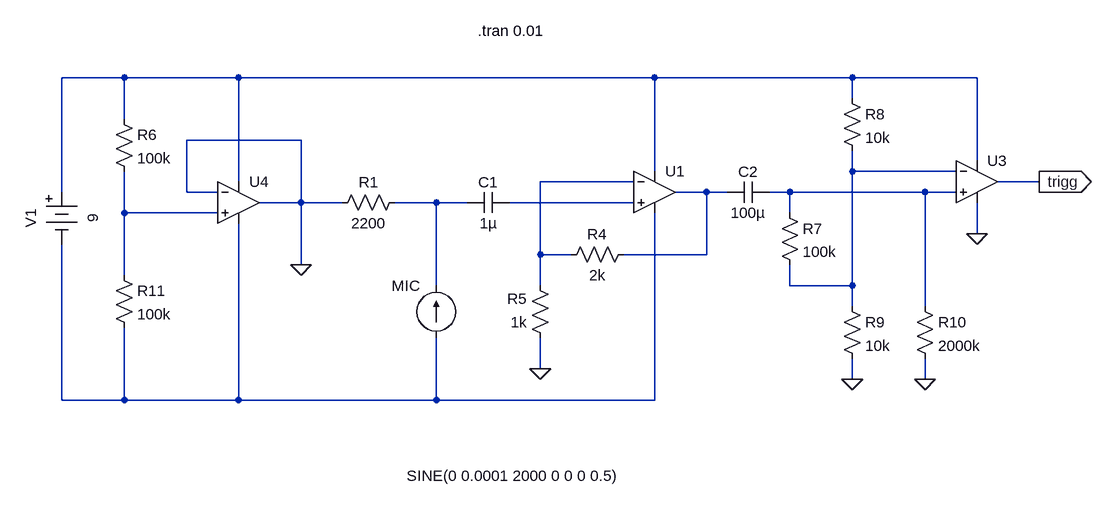
[diagram p0: schematic condenser_mic_amp.asc]
condenser_mic_amp.asc, the LTspice schematic file:
Version 4
SHEET 1 1876 916
WIRE -592 -160 -688 -160
WIRE -416 -160 -592 -160
WIRE 224 -160 -416 -160
WIRE 528 -160 224 -160
WIRE 720 -160 528 -160
WIRE 528 -128 528 -160
WIRE -592 -96 -592 -160
WIRE -320 -64 -496 -64
WIRE 720 -32 720 -160
WIRE 224 -16 224 -160
WIRE 528 -16 528 -48
WIRE 688 -16 528 -16
WIRE -416 0 -416 -160
WIRE 192 0 48 0
WIRE 816 0 752 0
WIRE -688 16 -688 -160
WIRE -496 16 -496 -64
WIRE -448 16 -496 16
WIRE 304 16 256 16
WIRE 336 16 304 16
WIRE 432 16 400 16
WIRE 640 16 432 16
WIRE 688 16 640 16
WIRE -320 32 -320 -64
WIRE -320 32 -384 32
WIRE -256 32 -320 32
WIRE -112 32 -176 32
WIRE -64 32 -112 32
WIRE 192 32 0 32
WIRE -592 48 -592 -16
WIRE -448 48 -592 48
WIRE 432 48 432 16
WIRE 720 80 720 32
WIRE 48 112 48 0
WIRE 96 112 48 112
WIRE 304 112 304 16
WIRE 304 112 176 112
WIRE -320 128 -320 32
WIRE -592 144 -592 48
WIRE -112 160 -112 32
WIRE 48 160 48 112
WIRE 432 160 432 128
WIRE 528 160 528 -16
WIRE 528 160 432 160
WIRE 528 192 528 160
WIRE 640 192 640 16
WIRE 48 288 48 240
WIRE 528 304 528 272
WIRE 640 304 640 272
WIRE -688 336 -688 96
WIRE -592 336 -592 224
WIRE -592 336 -688 336
WIRE -416 336 -416 64
WIRE -416 336 -592 336
WIRE -112 336 -112 240
WIRE -112 336 -416 336
WIRE 224 336 224 48
WIRE 224 336 -112 336
FLAG 48 288 0
FLAG 720 80 0
FLAG 528 304 0
FLAG 816 0 trigg
IOPIN 816 0 Out
FLAG 640 304 0
FLAG -320 128 0
SYMBOL cap 0 16 R90
WINDOW 0 0 32 VBottom 2
WINDOW 3 32 32 VTop 2
SYMATTR InstName C1
SYMATTR Value 1µ
SYMBOL res 192 96 R90
WINDOW 0 0 56 VBottom 2
WINDOW 3 32 56 VTop 2
SYMATTR InstName R4
SYMATTR Value 2k
SYMBOL res 64 256 R180
WINDOW 0 36 76 Left 2
WINDOW 3 36 40 Left 2
SYMATTR InstName R5
SYMATTR Value 1k
SYMBOL cap 400 0 R90
WINDOW 0 0 32 VBottom 2
WINDOW 3 32 32 VTop 2
SYMATTR InstName C2
SYMATTR Value 100µ
SYMBOL res 416 32 R0
SYMATTR InstName R7
SYMATTR Value 100k
SYMBOL OpAmps\\UniversalOpAmp2 720 0 R0
SYMATTR InstName U3
SYMBOL res 512 -144 R0
SYMATTR InstName R8
SYMATTR Value 10k
SYMBOL res 512 176 R0
SYMATTR InstName R9
SYMATTR Value 10k
SYMBOL res 624 176 R0
SYMATTR InstName R10
SYMATTR Value 2000k
SYMBOL OpAmps\\UniversalOpAmp2 224 16 R0
SYMATTR InstName U1
SYMBOL res -160 16 R90
WINDOW 0 0 56 VBottom 2
WINDOW 3 32 56 VTop 2
SYMATTR InstName R1
SYMATTR Value 2200
SYMBOL current -112 240 R180
WINDOW 0 24 80 Left 2
WINDOW 3 -283 -212 Left 2
WINDOW 123 0 0 Left 0
WINDOW 39 0 0 Left 0
SYMATTR InstName MIC
SYMATTR Value SINE(0 0.0001 2000 0 0 0 0.5)
SYMBOL OpAmps\\UniversalOpAmp2 -416 32 R0
SYMATTR InstName U4
SYMBOL Misc\\battery -688 0 R0
WINDOW 0 -32 56 VBottom 2
WINDOW 3 32 56 VTop 2
WINDOW 123 0 0 Left 0
WINDOW 39 0 0 Left 0
SYMATTR InstName V1
SYMATTR Value 9
SYMBOL res -608 -112 R0
SYMATTR InstName R6
SYMATTR Value 100k
SYMBOL res -608 128 R0
SYMATTR InstName R11
SYMATTR Value 100k
TEXT -48 -232 Left 2 !.tran 0.01

The netlist it stands for:
* condenser_mic_amp.asc
C1 N007 N006 1µ
R4 N004 N003 2k
R5 0 N003 1k
C2 N005 N004 100µ
R7 N005 N002 100k
XU3 N005 N002 N001 0 trigg level2 Avol=1Meg GBW=10Meg Slew=10Meg Ilimit=25m Rail=0 Vos=0 En=0 Enk=0 In=0 Ink=0 Rin=500Meg  ; pins In+ In- V+ V- OUT
R8 N001 N002 10k
R9 N002 0 10k
R10 N005 0 2000k
XU1 N007 N003 N001 N009 N004 level2 Avol=1Meg GBW=10Meg Slew=10Meg Ilimit=25m Rail=0 Vos=0 En=0 Enk=0 In=0 Ink=0 Rin=500Meg  ; pins In+ In- V+ V- OUT
R1 N006 0 2200
I§MIC N009 N006 SINE(0 0.0001 2000 0 0 0 0.5)
XU4 N008 0 N001 N009 0 level2 Avol=1Meg GBW=10Meg Slew=10Meg Ilimit=25m Rail=0 Vos=0 En=0 Enk=0 In=0 Ink=0 Rin=500Meg  ; pins In+ In- V+ V- OUT
V1 N001 N009 9
R6 N001 N008 100k
R11 N008 N009 100k
.tran 0.01
.lib UniversalOpAmp2.lib
.backanno
.end